# Altium schematic sheet AD & i2C & SPI.SchDoc
size 393 x 281 mm
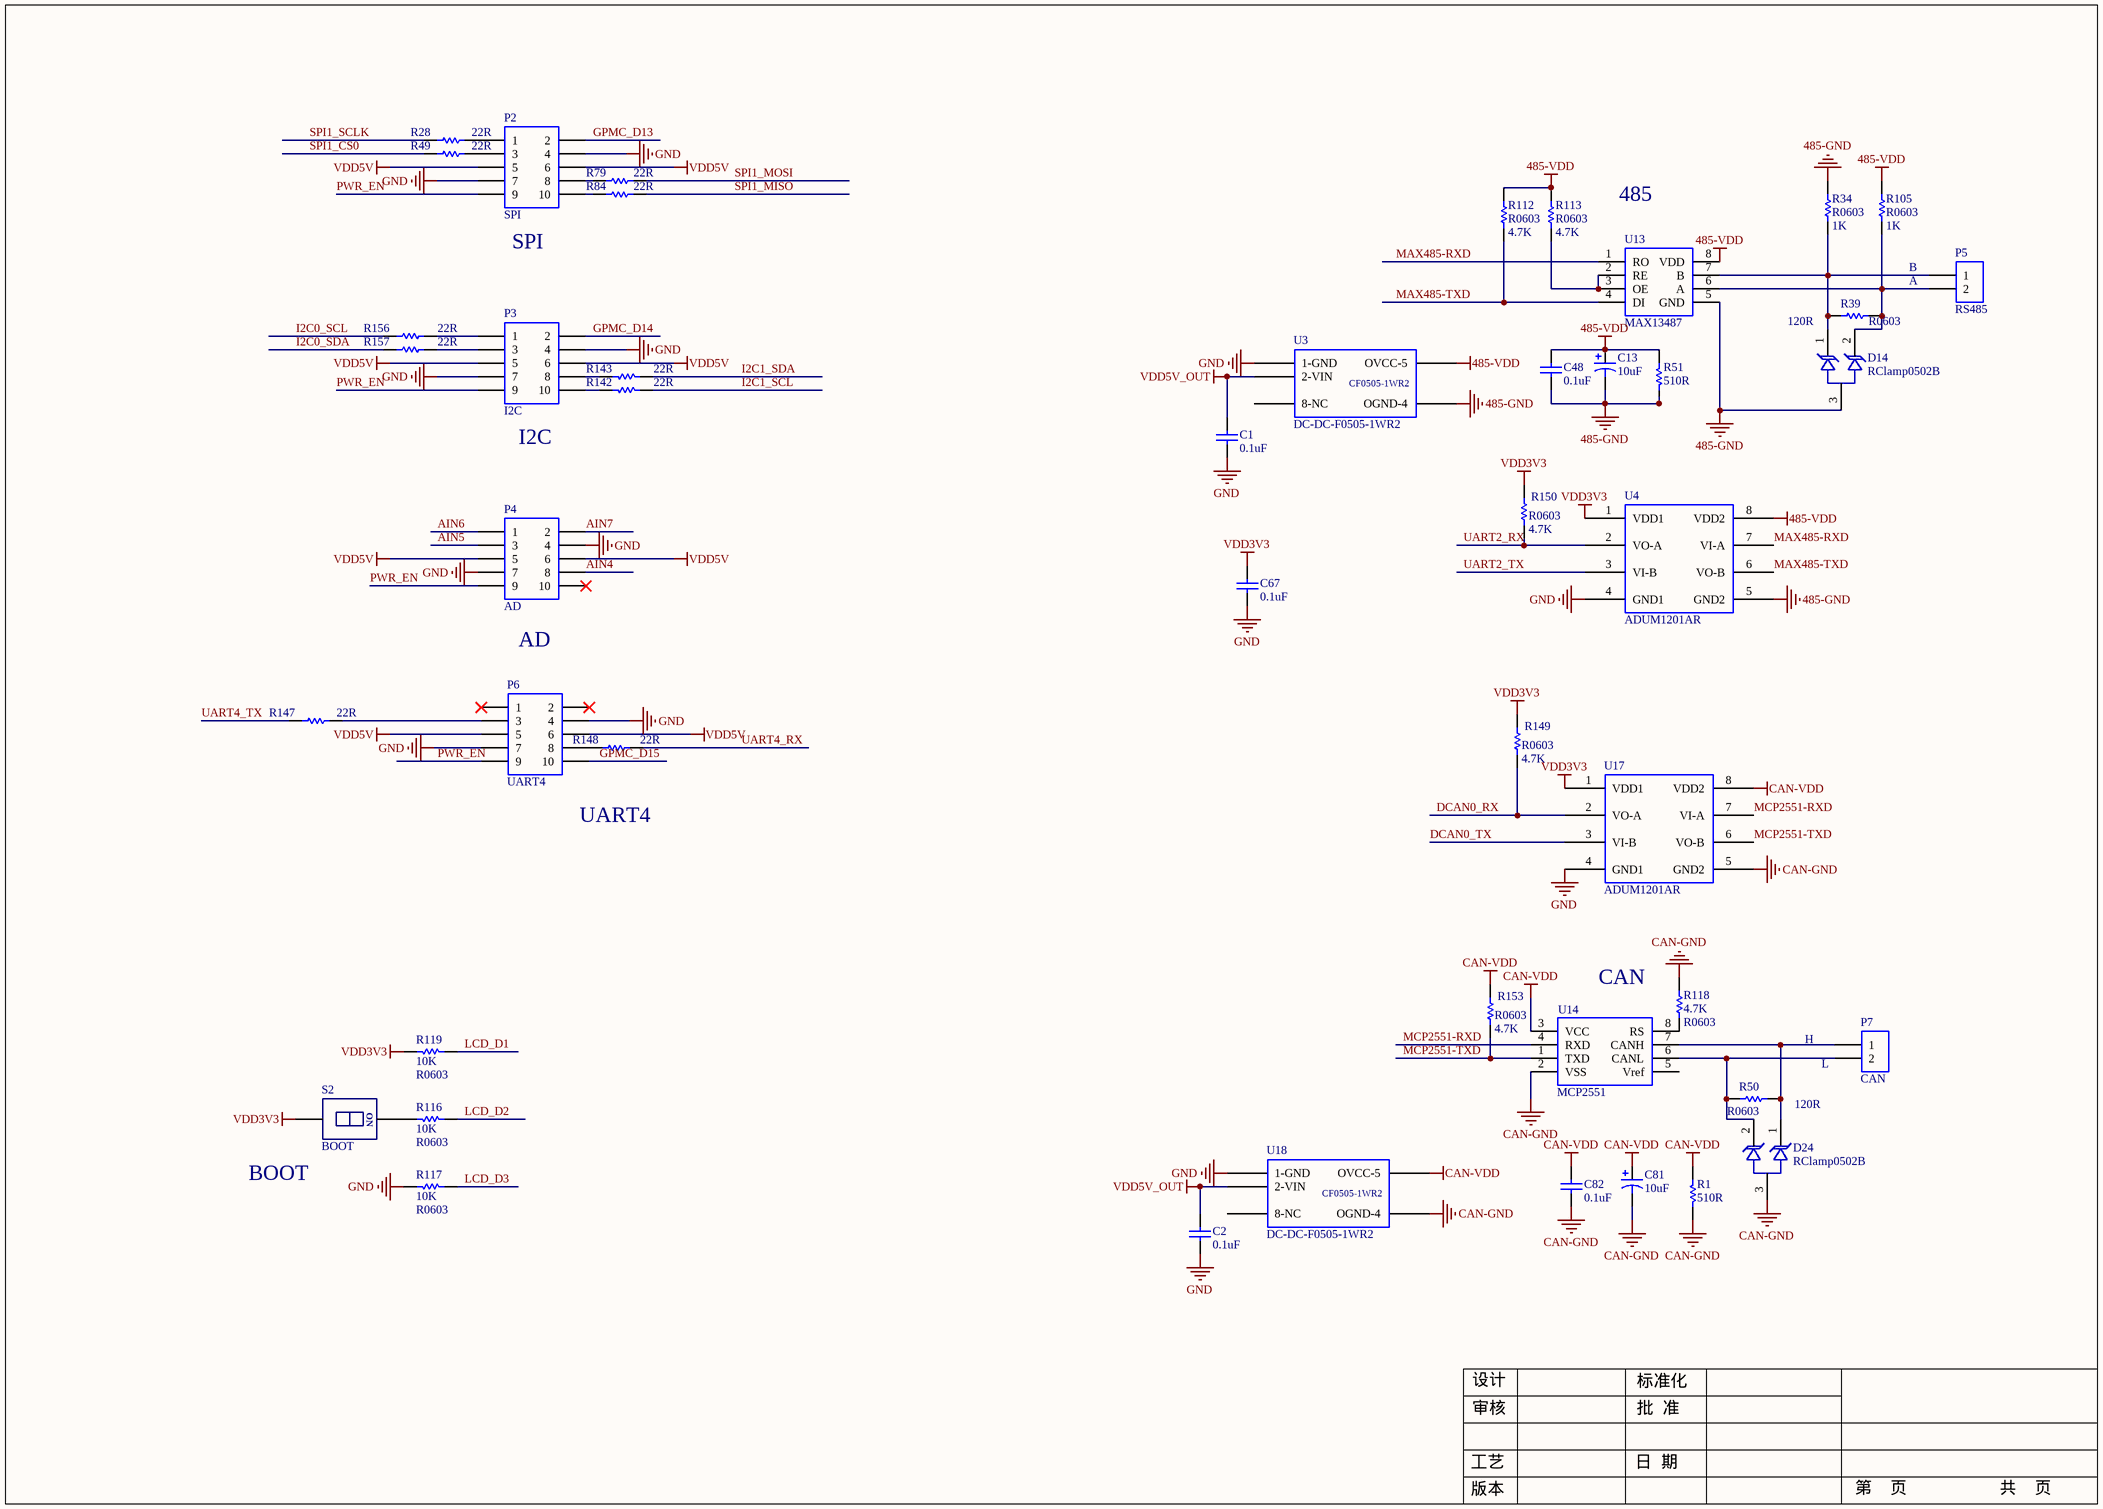
[diagram p0: AD & i2C & SPI.SchDoc]

## Parts
C1  value 0.1uF  [C0603_M1608]  (hidden comment: C0603)
C2  value 0.1uF  [C0603_M1608]  (hidden comment: C0603)
C13  value 10uF  [TC3216A]  (hidden comment: Cap Pol3)
C48  value 0.1uF  [C0603_M1608]  (hidden comment: C0603)
C67  value 0.1uF  [C0603_M1608]  (hidden comment: C0603)
C81  value 10uF  [TC3216A]  (hidden comment: Cap Pol3)
C82  value 0.1uF  [C0603_M1608]  (hidden comment: C0603)
D14  value RClamp0502B  [SOT-523]  (hidden comment: LCTVS)
D24  value RClamp0502B  [SOT-523]  (hidden comment: LCTVS)
P2  SPI  [IDC10S]
P3  I2C  [IDC10S]
P4  AD  [IDC10S]
P5  RS485  [2EDGKA-5.08-2P]
P6  UART4  [IDC10S]
P7  CAN  [2EDGKA-5.08-2P]
R1  value 510R  [1206]  (hidden comment: R1808)
R28  value 22R  [R0603_M1608]  (hidden comment: R0603)
R34  R0603  value 1K  [R0603_M1608]
R39  R0603  value 120R  [R0603_M1608]
R49  value 22R  [R0603_M1608]  (hidden comment: R0603)
R50  R0603  value 120R  [R0603_M1608]
R51  value 510R  [1206]  (hidden comment: R1808)
R79  value 22R  [R0603_M1608]  (hidden comment: R0603)
R84  value 22R  [R0603_M1608]  (hidden comment: R0603)
R105  R0603  value 1K  [R0603_M1608]
R112  R0603  value 4.7K  [R0603_M1608]
R113  R0603  value 4.7K  [R0603_M1608]
R116  10K  value R0603  [R0603_M1608]
R117  10K  value R0603  [R0603_M1608]
R118  4.7K  value R0603  [R0603_M1608]
R119  10K  value R0603  [R0603_M1608]
R142  value 22R  [R0603_M1608]  (hidden comment: R0603)
R143  value 22R  [R0603_M1608]  (hidden comment: R0603)
R147  value 22R  [R0603_M1608]  (hidden comment: R0603)
R148  value 22R  [R0603_M1608]  (hidden comment: R0603)
R149  R0603  value 4.7K  [R0603_M1608]
R150  R0603  value 4.7K  [R0603_M1608]
R153  R0603  value 4.7K  [R0603_M1608]
R156  value 22R  [R0603_M1608]  (hidden comment: R0603)
R157  value 22R  [R0603_M1608]  (hidden comment: R0603)
S2  BOOT  [SWITCH_1P]
U3  DC-DC-F0505-1WR2  [CF0505-1WR2]
U4  ADUM1201AR  [SO8_N - ADUM1201]
U13  MAX13487  [SOIC-8N]
U14  MCP2551  [SOIC-8N]
U17  ADUM1201AR  [SO8_N - ADUM1201]
U18  DC-DC-F0505-1WR2  [CF0505-1WR2]

## Nets
485-GND: C13.2 C48.1 D14.3 R34.1 R51.2 U3.4(OGND-4) U4.5(GND2) U13.5(GND)
485-VDD: C13.1 C48.2 R51.1 R105.1 R112.1 R113.1 U3.5(OVCC-5) U4.8(VDD2) U13.8(VDD)
CAN-GND: C81.2 C82.1 D24.3 R1.2 R118.1 U14.2(VSS) U17.5(GND2) U18.4(OGND-4)
CAN-VDD: C81.1 C82.2 R1.1 R153.1 U14.3(VCC) U17.8(VDD2) U18.5(OVCC-5)
GND: C1.1 C2.1 C67.1 P2.4 P2.7 P3.4 P3.7 P4.4 P4.7 P6.4 P6.7 R117.2 U3.1(1-GND) U4.4(GND1) U17.4(GND1) U18.1(1-GND)
VDD3V3: C67.2 R119.2 R149.1 R150.1 S2.1 U4.1(VDD1) U17.1(VDD1)
VDD5V: P2.5 P2.6 P3.5 P3.6 P4.5 P4.6 P6.5 P6.6
VDD5V_OUT: C1.2 C2.2 U3.2(2-VIN) U18.2(2-VIN)
AIN4: P4.8
AIN5: P4.3
AIN6: P4.1
AIN7: P4.2
DCAN0_RX: R149.2 U17.2(VO-A)
DCAN0_TX: U17.3(VI-B)
GPMC_D13: P2.2
GPMC_D14: P3.2
GPMC_D15: P6.10
I2C0_SCL: R156.2
I2C0_SDA: R157.2
I2C1_SCL: R142.1
I2C1_SDA: R143.1
LCD_D1: R119.1
LCD_D2: R116.1
LCD_D3: R117.1
MAX485-RXD: U4.7(VI-A) U13.1(RO)
MAX485-TXD: R112.2 U4.6(VO-B) U13.4(DI)
MCP2551-RXD: U14.4(RXD) U17.7(VI-A)
MCP2551-TXD: R153.2 U14.1(TXD) U17.6(VO-B)
PWR_EN: P2.9 P3.9 P4.9 P6.9
SPI1_CS0: R49.2
SPI1_MISO: R84.1
SPI1_MOSI: R79.1
SPI1_SCLK: R28.2
UART2_RX: R150.2 U4.2(VO-A)
UART2_TX: U4.3(VI-B)
UART4_RX: R148.2
UART4_TX: R147.1
NetD14_1: D14.1 P5.1 R34.2 R39.2 U13.7(B)
NetD14_2: D14.2 P5.2 R39.1 R105.2 U13.6(A)
NetD24_1: D24.1 P7.1 R50.1 U14.7(CANH)
NetD24_2: D24.2 P7.2 R50.2 U14.6(CANL)
NetP2_1: P2.1 R28.1
NetP2_3: P2.3 R49.1
NetP2_8: P2.8 R79.2
NetP2_10: P2.10 R84.2
NetP3_1: P3.1 R156.1
NetP3_3: P3.3 R157.1
NetP3_8: P3.8 R143.2
NetP3_10: P3.10 R142.2
NetP6_3: P6.3 R147.2
NetP6_8: P6.8 R148.1
NetR113_2: R113.2 U13.2(RE) U13.3(OE)
NetR116_2: R116.2 S2.2
NetR118_2: R118.2 U14.8(RS)

Not connected (* = marked no-connect by the designer): P4 10*; P6 1* 2*; U3 8(8-NC); U14 5(Vref); U18 8(8-NC)

## Notes on the sheet
- 485
- (near P2) SPI
- A
- B
- (near P3) I2C
- AD
- UART4
- CAN
- (near P7) H
- L
- (near S2) BOOT
- 设计
- 标准化
- 审核
- 批  准
- 版本
- 工艺
- 日  期
- 第    页
- 共    页
- (in symbol DC-DC-F0505-1WR2) CF0505-1WR2
- (in symbol SW DIP-1) ON

## Library data of the parts
C1 C2 C48 C67 C82 = Cap: Capacitor; Published: 8-Jun-2000; LatestRevisionDate: 17-Jul-2002; LatestRevisionNote: Re-released for DXP Platform.; PackageReference: RAD-0.3; Publisher: Altium Limited
C13 C81 = Cap Pol3: Polarized Capacitor (Surface Mount); Published: 8-Jun-2000; LatestRevisionDate: 29-May-2009; LatestRevisionNote: IPC-7351 Footprint Added.; PackageReference: C0805; Publisher: Altium Limited; PackageDescription: Chip Capacitor
P2-P4 P6 = Header 5X2: Header, 5-Pin, Dual row; LatestRevisionDate: 17-Jul-2002; LatestRevisionNote: Re-released for DXP Platform.; Publisher: Altium Limited
P5 P7 = Header 2: Header, 2-Pin; LatestRevisionDate: 17-Jul-2002; LatestRevisionNote: Re-released for DXP Platform.; Publisher: Altium Limited
R1 R28 R34 R39 R49-R51 R79 R84 R105 R112 R113 R142 R143 R147-R150 R153 R156 R157 = Res1: Resistor; Published: 8-Jun-2000; LatestRevisionDate: 17-Jul-2002; LatestRevisionNote: Re-released for DXP Platform.; PackageReference: AXIAL-0.3; Publisher: Altium Limited
R116-R119 = Res1: R0603; Published: 8-Jun-2000; LatestRevisionDate: 17-Jul-2002; LatestRevisionNote: Re-released for DXP Platform.; PackageReference: AXIAL-0.3; Publisher: Altium Limited; PackageDescription: Axial Device, Thru-Hole; 2 Leads; 0.3 in Pin Spacing
S2 = SW DIP-1
U4 U17 = ADuM1201
U13 = MAX485: SOIC8
U14 = MCP2551: SOIC8